# EAGLE design motor_control (EAGLE 7.3.0)
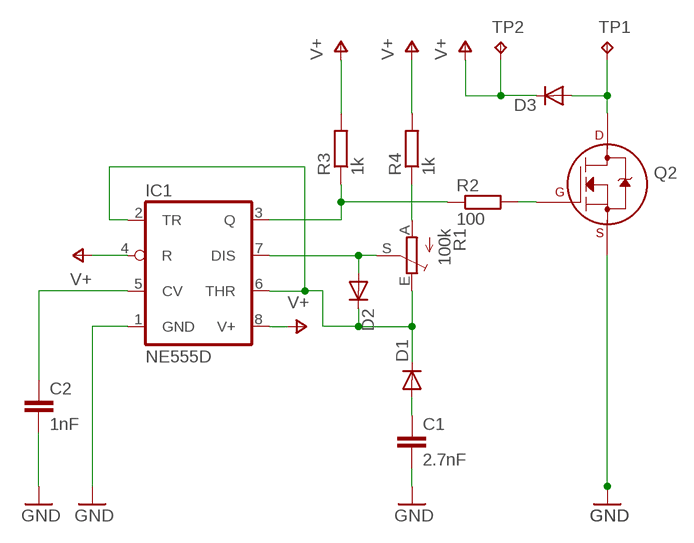
[diagram p0: schematic, sheet 1]

## Parts
C1  2.7nF  C-EUC0805  [C0805]
C2  1nF  C-EUC0805  [C0805]
D1  DIODE-SMB  [SMB]
D2  DIODE-SMB  [SMB]
D3  DIODE-SMB  [SMB]
IC1  NE555D  [SO08]
Q2  2N7000_SOT23  [SOT-23]
R1  100k  TRIM_EU-CA6V  [CA6V]
R2  100  R-EU_R0805  [R0805]
R3  1k  R-EU_R0805  [R0805]
R4  1k  R-EU_R0805  [R0805]
TP1  TPB2,54  [B2,54]
TP2  TPB2,54  [B2,54]

## Nets
GND: C1.2 C2.2 IC1.1(GND) Q2.2(S)
N$3: D1.C D2.C IC1.2(TR) IC1.6(THR) R1.E
N$4: C2.1 IC1.5(CV)
N$5: D2.A IC1.7(DIS) R1.S
N$6: Q2.1(G) R2.2
N$7: IC1.3(Q) R2.1 R3.1
N$8: D3.A Q2.3(D) TP1.TP
N$9: C1.1 D1.A
N$10: R1.A R4.1
V+: D3.C IC1.4(R) IC1.8(V+) R3.2 R4.2 TP2.TP

## Library data of the parts
C1 C2 = rcl:C-EU: CAPACITOR, European symbol
D1-D3 = diode:DIODE-: DIODE
IC1 = linear:*555: TIMER
Q2 = transistors:2N700*: 2N7000, 2N7002, NDS7002A N-channel enhancement mode MOSFET
R1 = pot:TRIM_EU-: POTENTIOMETER
R2-R4 = rcl:R-EU_: RESISTOR, European symbol
TP1 TP2 = testpad:TP: Test pad

## Board
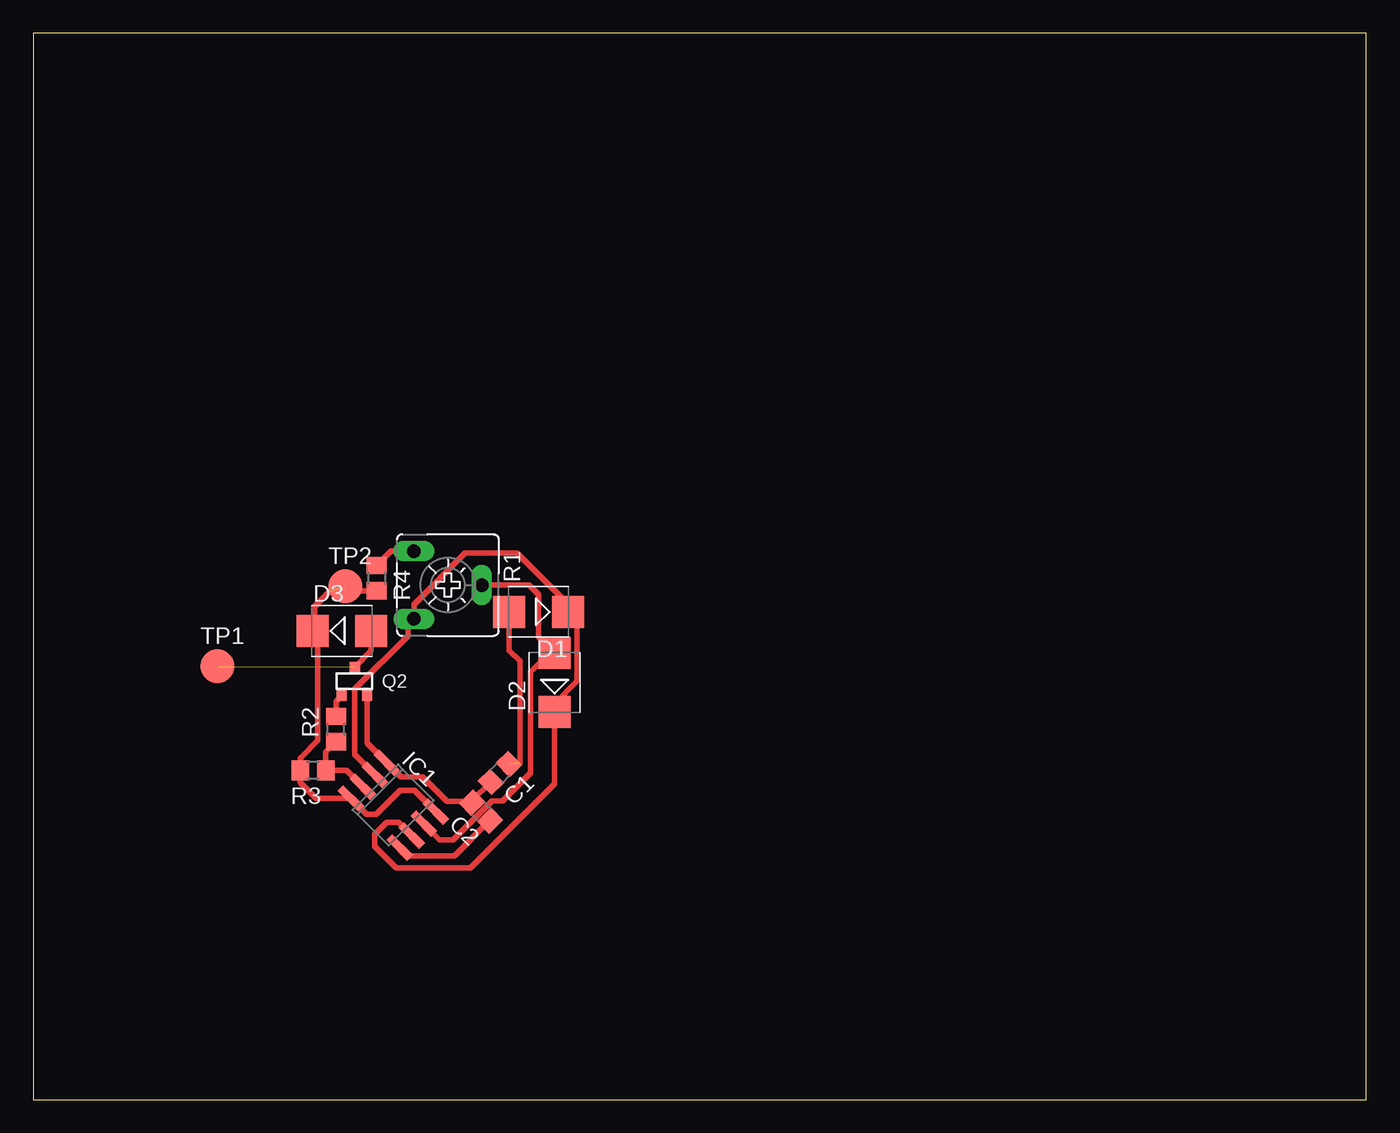
[diagram p1: board, top side]

Size 100 x 80 mm. Coordinates in mm from the lower left corner, seen from the top.
Outline: 0,0 100,0 100,80 0,80 0,0
Copper layers (1*16): Top 0.035mm / dielectric 1.5mm / Bottom 0.035mm
Design rules "default": minimum track width 10mil, minimum drill 24mil, track to track 8mil, track to pad 8mil, pad to pad 8mil, via to via 8mil, smd to smd 8mil, copper to edge 40mil, drill to drill 8mil, minimum pad ring 10mil, minimum via ring 8mil, stop-mask expansion 4mil, vias tented up to drill 0mil, thermal gap 10mil

### Footprints (pad centres in the part's own frame; a part is rotated, then mirrored left to right if it is on the bottom)
C0805 = smd 1.3 x 1.5: 1 -0.95,0; 2 0.95,0
SMB = smd 2.4 x 2.4: A 2.2,0; C -2.2,0
SO08 = smd 0.6 x 2.2: 1 -1.905,-2.6; 2 -0.635,-2.6; 3 0.635,-2.6; 4 1.905,-2.6; 5 1.905,2.6; 6 0.635,2.6; 7 -0.635,2.6; 8 -1.905,2.6
SOT-23 = smd 0.762 x 0.762: 1 -0.979,-1.101; 2 0.94,-1.101; 3 0.025,1.067
CA6V = drill 1.016 long: A -2.54,-2.54; E 2.54,-2.54; S 0,2.54
R0805 = smd 1.3 x 1.5: 1 -0.95,0; 2 0.95,0
B2,54 = smd 2.54 x 2.54: TP 0,0

### Placement (x,y rotation side)
C1  35,24.5 225 top
C2  33.6,21.6 135 top
D1  37.9,36.6 180 top
D2  39.1,31.3 90 top
D3  23.15,35.16 0 top
IC1  27,22.1 225 top
Q2  24.1,31.4 0 top
R1  31.1,38.6 270 top
R2  22.7,27.8 90 top
R3  20.99,24.68 180 top
R4  25.76,39.12 270 top
TP1  13.8,32.5 0 top
TP2  23.4,38.5 0 top

### Tracks (layer width: path | path; a pad name or v marks a point on that pad's centre or on a via)
__
  cutout Top (isolate 0.305): 17.5,29.5 arc-180 44.5,29.5 arc-180
GND
  Top 0.406: 32.93,22.37 32.93,22.43 C1.2 | C2.2 32.93,22.37 | Q2.2 25.04,26.75 IC1.1 27.59,24.2 29.2,24.2 31.03,22.37 32.93,22.37
N$2
  cutout Top: 41.5,32 43.3,32 43.3,27 41.5,27
N$3
  Top 0.406: IC1.2 24.1,25.9 24.1,30.8 28.1,34.8 28.1,35.6 R1.E 28.56,37.16 32.4,41 36.3,41 40.3,37 D1.C 40.8,35.9 40.8,31.4 39.1,29.7 D2.C 39.1,23.7 32.8,17.4 27.2,17.4 25.6,19 25.6,19.9 26.5,20.8 27.4,20.8 IC1.6
N$4
  Top 0.406: C2.1 34.23,20.93 31.6,18.3 28.11,18.3 IC1.5
N$5
  Top 0.406: R1.S 37.2,38.6 37.9,37.9 37.9,34.7 D2.A 38.7,33.5 37.3,32.1 37.3,24.5 35.2,22.4 34.4,22.4 31.5,19.5 30.5,19.5 IC1.7
N$6
  Top 0.406: R2.2 22.7,29.88 Q2.1
N$7
  Top 0.406: R2.1 21.94,26.09 R3.1 23.52,24.68 IC1.3
N$8  (1 unrouted)
  Top 0.406: D3.A 25.35,33.69 Q2.3
N$9  (1 unrouted)
  Top 0.406: D1.A 35.7,33.7 36.5,32.9 36.5,25.25
N$10
  Top 0.406: R1.A 26.83,41.14 R4.1
N$12
  cutout Top: 26,29.5 arc-180 36,29.5 arc-180
N$13
  cutout Top: 18.7,32 20.5,32 20.5,27 18.7,27
V+  (1 unrouted)
  Top 0.406: R4.2 22.27,38.17 21.1,37 21.1,35.31 D3.C 21.34,34.77 21.34,26.94 20.04,25.64 | 20.04,25.64 R3.2 20,24.64 20,23.8 21.21,22.59 IC1.4 25,21.4 25.7,21.4 27.5,23.2 28.6,23.2 IC1.8 | 20.04,25.64 20,25.6